# EAGLE design brick_serial_usb (EAGLE 7.2.0)
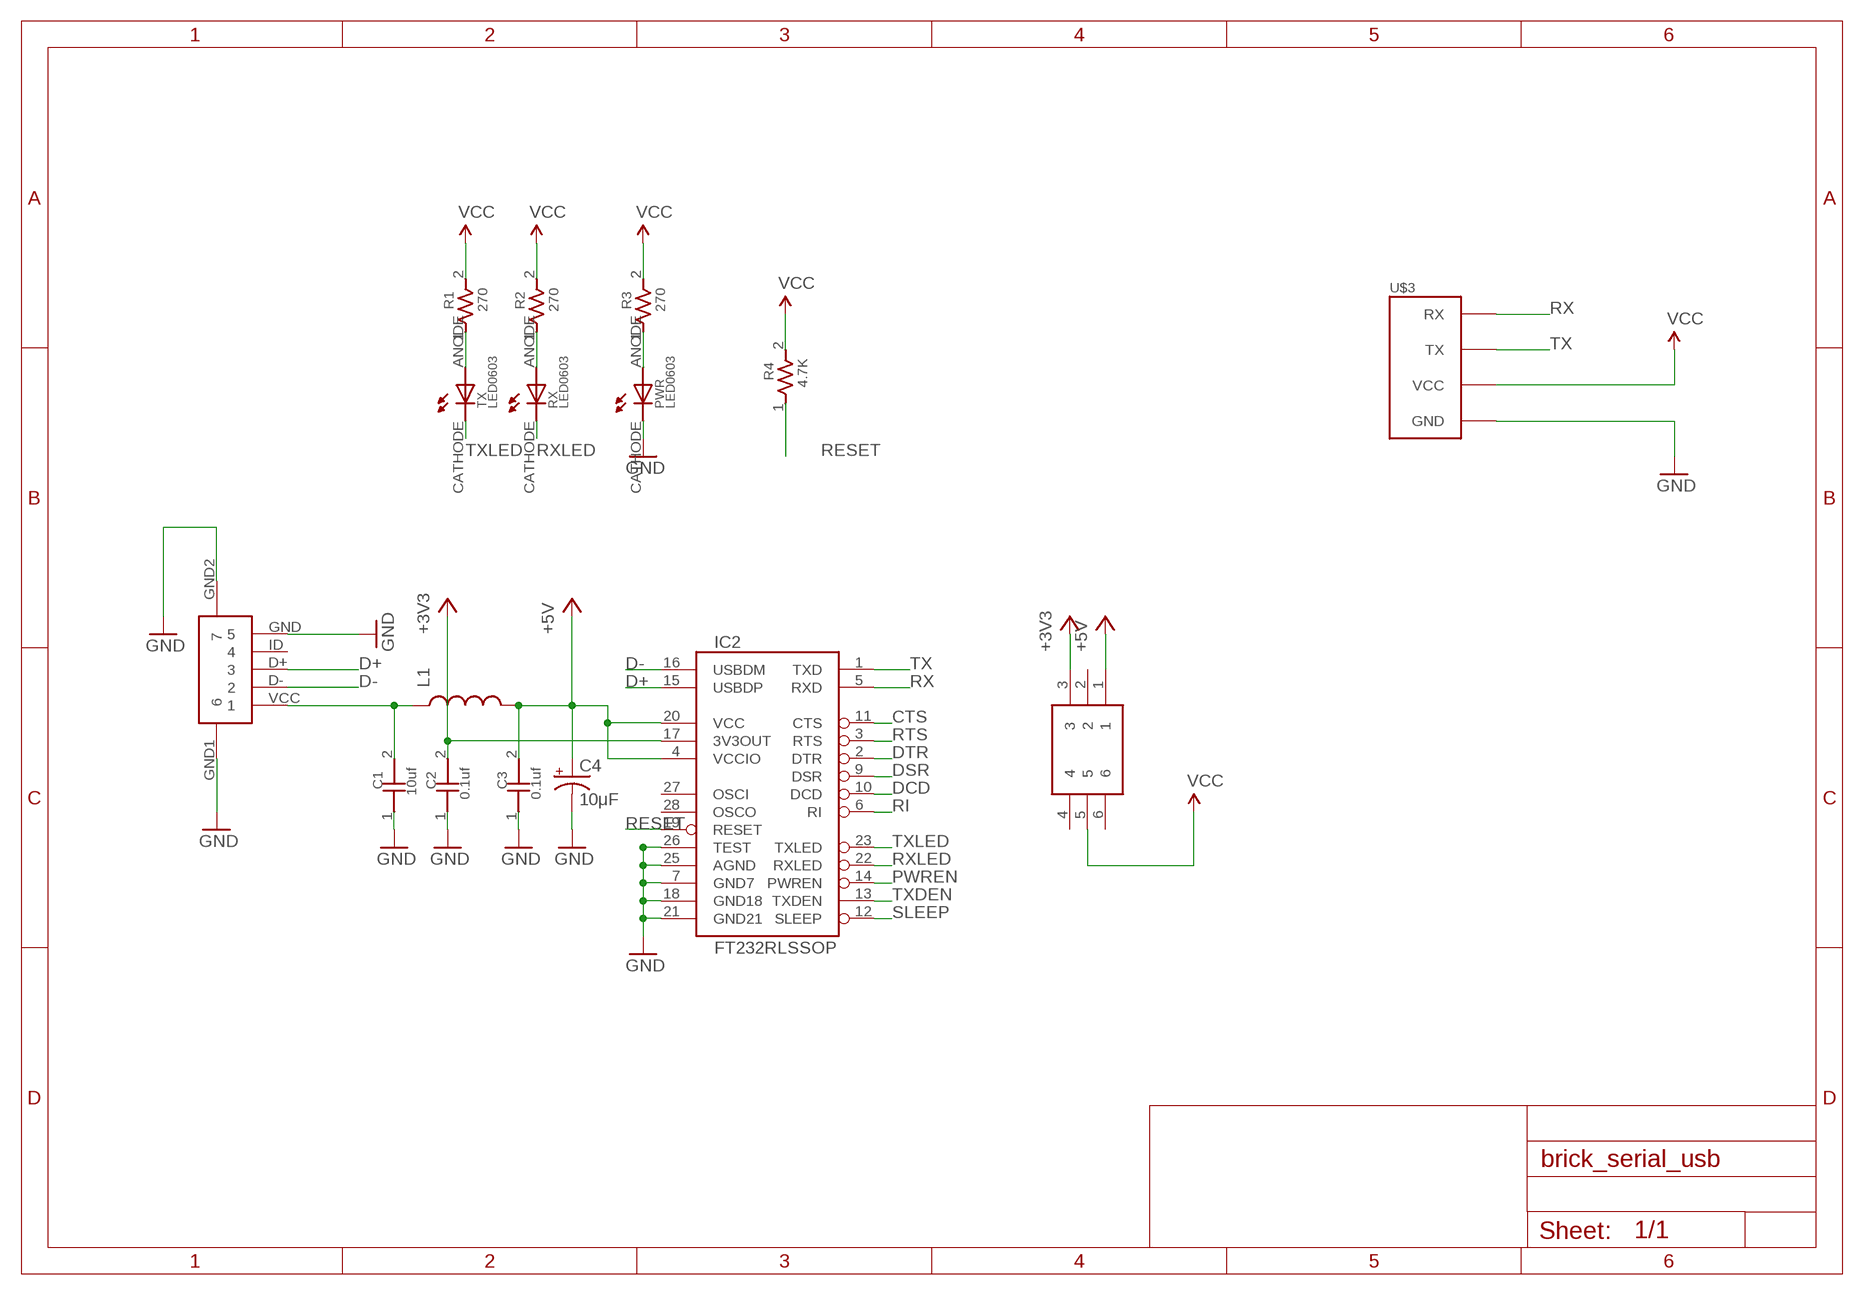
[diagram p0: schematic, sheet 1]

## Parts
C1  10uf  CAPACITOR0603  [0603]
C2  0.1uf  CAPACITOR0603  [0603]
C3  0.1uf  CAPACITOR0603  [0603]
C4  10μF  CAP_POL1206  [EIA3216]
IC2  FT232RLSSOP  [SSOP28DB]
L1  INDUCTOR0603  [0603]
PWR  LED0603  [0603]
R1  270  RESISTOR0603  [0603]
R2  270  RESISTOR0603  [0603]
R3  270  RESISTOR0603  [0603]
R4  4.7K  RESISTOR0603  [0603]
RX  LED0603  [0603]
TX  LED0603  [0603]
U$1  USB-MICRO-B-FEMALE  [USB-MICRO-B-FEMALE]
U$2  C&K_JS202011SCQN  [C&K_JS202011SCQN]
U$3  BRICK_SERIAL  [BRICK_SERIAL]

## Nets
+3V3: C2.2 IC2.17(3V3OUT) U$2.3
+5V: C3.2 C4.A(+) IC2.4(VCCIO) IC2.20(VCC) L1.2 U$2.1
CTS: IC2.11(CTS)
D+: IC2.15(USBDP) U$1.D+
D-: IC2.16(USBDM) U$1.D-
DCD: IC2.10(DCD)
DSR: IC2.9(DSR)
DTR: IC2.2(DTR)
GND: C1.1 C2.1 C3.1 C4.C(-) IC2.7(GND7) IC2.18(GND18) IC2.21(GND21) IC2.25(AGND) IC2.26(TEST) PWR.CATHODE U$1.GND U$1.GND1 U$1.GND2 U$3.GND
N$1: C1.2 L1.1 U$1.VCC
N$2: R1.1 TX.ANODE
N$5: R2.1 RX.ANODE
N$6: PWR.ANODE R3.1
PWREN: IC2.14(PWREN)
RESET: IC2.19(RESET) R4.1
RI: IC2.6(RI)
RTS: IC2.3(RTS)
RX: IC2.5(RXD) U$3.RX
RXLED: IC2.22(RXLED) RX.CATHODE
SLEEP: IC2.12(SLEEP)
TX: IC2.1(TXD) U$3.TX
TXDEN: IC2.13(TXDEN)
TXLED: IC2.23(TXLED) TX.CATHODE
VCC: R1.2 R2.2 R3.2 R4.2 U$2.5 U$3.VCC
Unconnected: IC2.27(OSCI) IC2.28(OSCO) U$1.ID U$2.2 U$2.4 U$2.6

## Library data of the parts
C1-C3 = GClue-Capacitor:CAPACITOR
C4 = SparkFun:CAP_POL: Capacitor Polarized These are standard SMD and PTH capacitors. Normally 10uF, 47uF, and 100uF in electrolytic and tantalum varieties. Always verify the external diameter of the through hole cap, it varies with capacity, voltage, and manufacturer. The EIA devices should be standard.
IC2 = SparkFun:FT232RL: USB UART FT232RL 4th Generation USB UART (USB <-> Serial) Controller. Spark Fun Electronics SKU : COM-00650
L1 = SparkFun:INDUCTOR: Inductors Basic Inductor/Choke - 0603 and 1206. Footprints are not proven and vary greatly between part numbers.
PWR RX TX = GClue-LED:LED
R1-R4 = GClue-Resistors:RESISTOR
U$1 = gclue:USB-MICRO-B-FEMALE
U$2 = gclueParts:C&K_JS202011SCQN
U$3 = gclue:BRICK_SERIAL

## Board
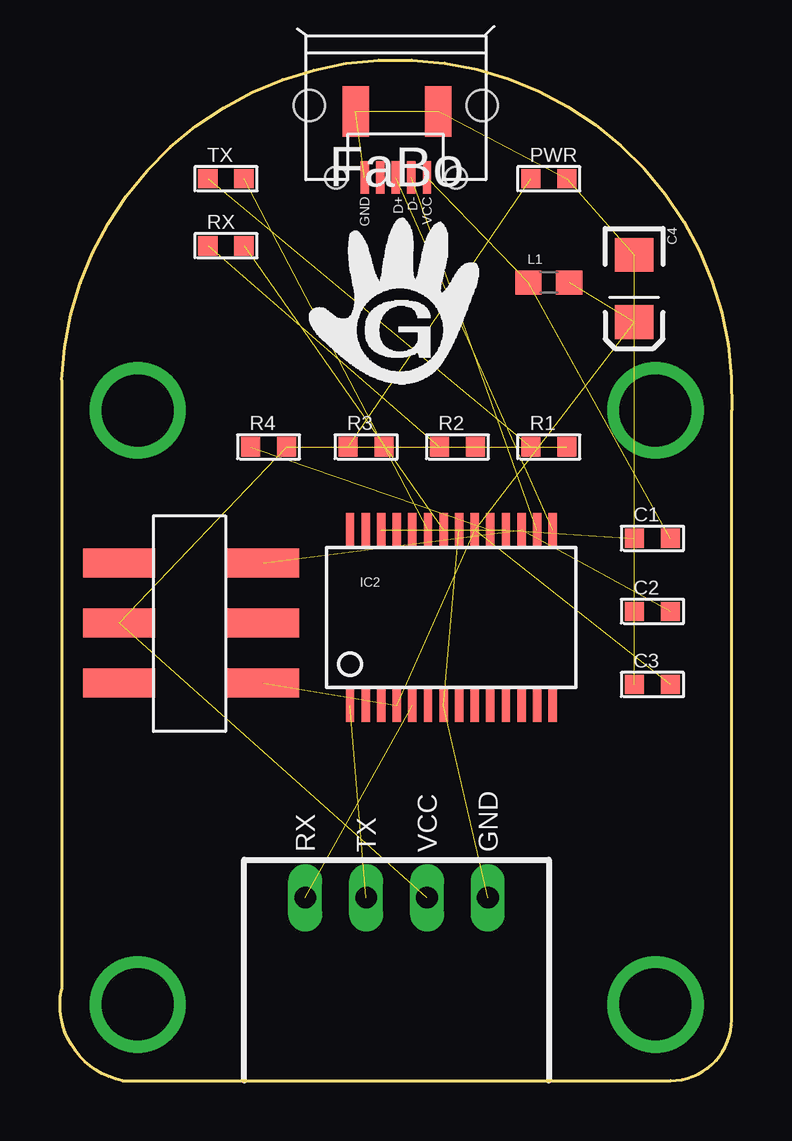
[diagram p1: board, top side]
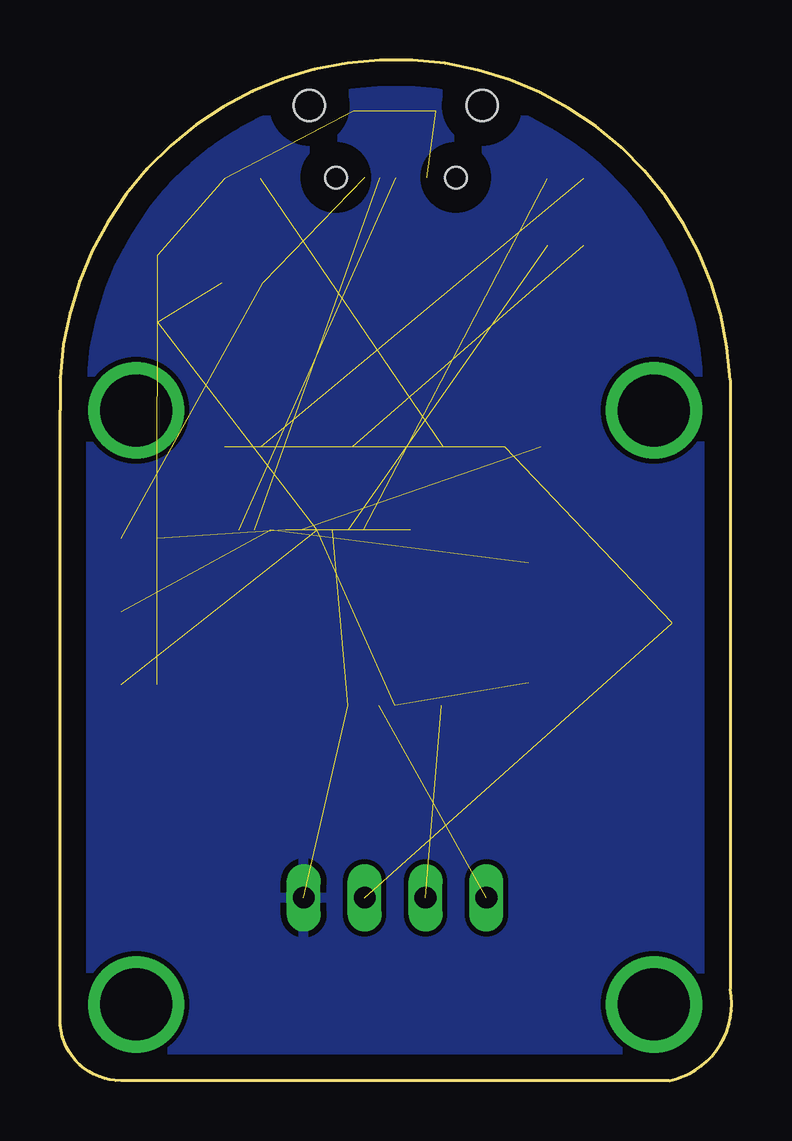
[diagram p2: board, bottom side, seen from below]

Size 28 x 42.55 mm. Coordinates in mm from the lower left corner, seen from the top.
Copper layers (1*16): Top 0.035mm / dielectric 1.5mm / Bottom 0.035mm
Design rules "default": minimum track width 10mil, minimum drill 24mil, track to track 8mil, track to pad 8mil, pad to pad 8mil, via to via 8mil, smd to smd 8mil, copper to edge 40mil, drill to drill 8mil, minimum pad ring 10mil, minimum via ring 8mil, stop-mask expansion 4mil, vias tented up to drill 0mil, thermal gap 10mil

### Footprints (pad centres in the part's own frame; a part is rotated, then mirrored left to right if it is on the bottom)
0603 = smd 0.8 x 0.8: 1 -0.75,0; 2 0.75,0
EIA3216 = smd 1.4 x 1.6: A 1.4,0; C -1.4,0
SSOP28DB = smd 0.348 x 1.397: 1 -4.225,-3.656; 2 -3.575,-3.656; 3 -2.925,-3.656; 4 -2.275,-3.656; 5 -1.625,-3.656; 6 -0.975,-3.656; 7 -0.325,-3.656; 8 0.325,-3.656; 9 0.975,-3.656; 10 1.625,-3.656; 11 2.275,-3.656; 12 2.925,-3.656; 13 3.575,-3.656; 14 4.225,-3.656; 15 4.225,3.656; 16 3.575,3.656; 17 2.925,3.656; 18 2.275,3.656; 19 1.625,3.656; 20 0.975,3.656; 21 0.325,3.656; 22 -0.325,3.656; 23 -0.975,3.656; 24 -1.625,3.656; 25 -2.275,3.656; 26 -2.925,3.656; 27 -3.575,3.656; 28 -4.225,3.656
0603' = smd 1.1 x 1: 1 -0.85,0; 2 0.85,0
0603'' = smd 0.8 x 0.8: ANODE -0.75,0; CATHODE 0.75,0
USB-MICRO-B-FEMALE = smd 1.35 x 0.35: D+ 3,0; D- 3,0.65; GND 3,-1.3; ID 3,-0.65; VCC 3,1.3 | smd 2.1 x 1.1: GND1 0.246,1.77; GND2 0.246,-1.67 | hole 1.3: 0,3.6; 0,-3.6 | hole 0.9: 3,2.5; 3,-2.5
C&K_JS202011SCQN = smd 3 x 1.2: 1 -3.07,2.47; 2 -3.07,-0.03; 3 -3.07,-2.53; 4 2.93,-2.53; 5 2.93,-0.03; 6 2.93,2.47
BRICK_SERIAL = drill 0.9 long: GND 3.81,-11.43; RX -3.81,-11.43; TX -1.27,-11.43; VCC 1.27,-11.43 | drill 3 pad 3.81: P$5 -10.795,8.89; P$6 10.795,8.89; P$7 -10.795,-15.875; P$8 10.795,-15.875

### Placement (x,y rotation side)
C1  24.7,22.61 0 top
C2  24.7,19.56 0 top
C3  24.7,16.51 0 top
C4  23.94,33.02 270 top
IC2  16.32,19.3 0 top
L1  [0603']  20.38,33.27 0 top
PWR  LED0603  [0603'']  20.38,37.59 0 top
R1  20.38,26.42 0 top
R2  16.57,26.42 0 top
R3  12.76,26.42 0 top
R4  8.7,26.42 0 top
RX  LED0603  [0603'']  6.92,34.8 0 top
TX  LED0603  [0603'']  6.92,37.59 0 top
U$1  14,40.65 270 top
U$2  5.4,19.05 180 top
U$3  14.03,19.05 0 top

### Tracks (layer width: path | path; a pad name or v marks a point on that pad's centre or on a via)
+3V3  (2 unrouted)
+5V  (5 unrouted)
D+  (1 unrouted)
D-  (1 unrouted)
GND  (13 unrouted)
  pour Bottom: -0.7,-1.02 29.27,-0.76 29.27,42.93 -0.95,42.93
N$1  (2 unrouted)
N$2  (1 unrouted)
N$5  (1 unrouted)
N$6  (1 unrouted)
RESET  (1 unrouted)
RX  (1 unrouted)
RXLED  (1 unrouted)
TX  (1 unrouted)
TXLED  (1 unrouted)
VCC  (5 unrouted)